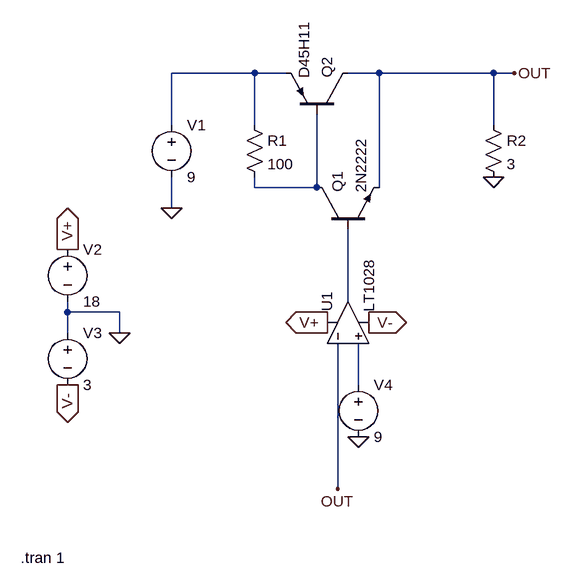
[diagram p0: schematic pass_compound.asc]
pass_compound.asc, the LTspice schematic file:
Version 4
SHEET 1 880 828
WIRE 96 64 -32 64
WIRE 144 64 96 64
WIRE 288 64 240 64
WIRE 464 64 288 64
WIRE 496 64 464 64
WIRE -32 144 -32 64
WIRE 96 144 96 64
WIRE 464 144 464 64
WIRE 96 240 96 224
WIRE 192 240 192 128
WIRE 192 240 96 240
WIRE 288 240 288 64
WIRE -32 272 -32 224
WIRE 240 416 240 304
WIRE -192 432 -192 416
WIRE -112 432 -192 432
WIRE -192 464 -192 432
WIRE -112 464 -112 432
WIRE 256 544 256 480
WIRE 224 704 224 480
FLAG -32 272 0
FLAG 464 224 0
FLAG -112 464 0
FLAG -192 336 V+
IOPIN -192 336 Out
FLAG 208 448 V+
IOPIN 208 448 Out
FLAG 272 448 V-
IOPIN 272 448 Out
FLAG -192 544 V-
IOPIN -192 544 Out
FLAG 224 704 OUT
FLAG 496 64 OUT
FLAG 256 624 0
SYMBOL npn 192 304 R270
SYMATTR InstName Q1
SYMATTR Value 2N2222
SYMBOL pnp 240 128 M270
SYMATTR InstName Q2
SYMATTR Value D45H11
SYMBOL voltage -32 128 R0
WINDOW 123 0 0 Left 2
WINDOW 39 0 0 Left 2
SYMATTR InstName V1
SYMATTR Value 9
SYMBOL res 80 128 R0
SYMATTR InstName R1
SYMATTR Value 100
SYMBOL res 448 128 R0
SYMATTR InstName R2
SYMATTR Value 3
SYMBOL Opamps\\LT1028 176 448 R270
SYMATTR InstName U1
SYMBOL voltage -192 320 R0
WINDOW 123 0 0 Left 2
WINDOW 39 0 0 Left 2
SYMATTR InstName V2
SYMATTR Value 18
SYMBOL voltage -192 448 R0
WINDOW 123 0 0 Left 2
WINDOW 39 0 0 Left 2
SYMATTR InstName V3
SYMATTR Value 3
SYMBOL voltage 256 528 R0
WINDOW 123 0 0 Left 2
WINDOW 39 0 0 Left 2
SYMATTR InstName V4
SYMATTR Value 9
TEXT -264 810 Left 2 !.tran 1

The netlist it stands for:
* pass_compound.asc
Q1 N002 N003 OUT 0 2N2222
Q2 OUT N002 N001 0 D45H11
V1 N001 0 9
R1 N001 N002 100
R2 OUT 0 3
XU1 N004 OUT V+ V- N003 LT1028  ; pins In+ In- V+ V- OUT
V2 V+ 0 18
V3 0 V- 3
V4 N004 0 9
.model NPN NPN
.model PNP PNP
.lib standard.bjt
.tran 1
.lib LTC.lib
.backanno
.end